# Altium schematic sheet UVEEC LED Cube.SchDoc
size A; SheetNumber: 1; SheetTotal: 1
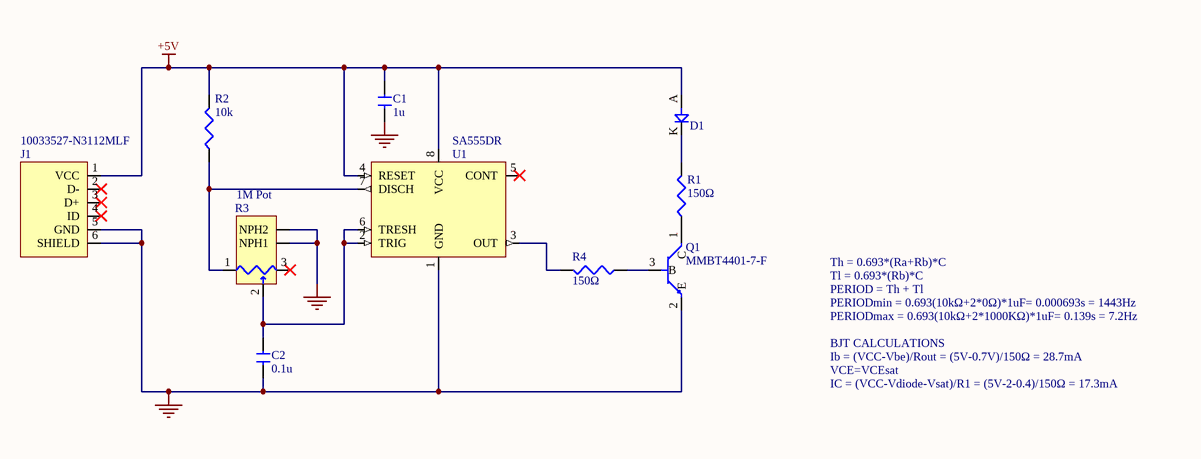
[diagram p0: UVEEC LED Cube.SchDoc]

## Parts
C1  1u  [Capacitor 1206]
C2  0.1u  [Capacitor 1206]
D1  HL3P-BF60-C00DD  [Diode TH D 1.05 P 2.54]  (value not drawn)
J1  10033527-N3112MLF  [10033527-N3112MLF]
Q1  MMBT4401-7-F  [SOT-23-3]
R1  150Ω  [Resistor 1206]
R2  10k  [Resistor 1206]
R3  1M Pot  [PDB12-H4301-105BF]
R4  150Ω  [Resistor 1206]
U1  SA555DR  [SOIC-8]

## Nets
+5V: C1.1 D1.A J1.1(VCC) R2.2 U1.4(RESET) U1.8(VCC)
GND: C1.2 C2.2 J1.5(GND) J1.6(SHIELD) Q1.2(E) R3.NPH1 R3.NPH2 U1.1(GND)
NetC2_1: C2.1 R3.2(WIPER) U1.2(TRIG) U1.6(TRESH)
NetD1_K: D1.K R1.2
NetQ1_1: Q1.1(C) R1.1
NetQ1_3: Q1.3(B) R4.1
NetR2_1: R2.1 R3.1(CCW) U1.7(DISCH)
NetR4_2: R4.2 U1.3(OUT)

Not connected (* = marked no-connect by the designer): J1 2(D-)* 3(D+)* 4(ID)*; R3 3(CW)*; U1 5(CONT)*

## Notes on the sheet
- Th = 0.693*(Ra+Rb)*C
- Tl = 0.693*(Rb)*C
- PERIOD = Th + Tl
- PERIODmin = 0.693(10kΩ+2*0Ω)*1uF= 0.000693s = 1443Hz
- PERIODmax = 0.693(10kΩ+2*1000KΩ)*1uF= 0.139s = 7.2Hz
- BJT CALCULATIONS
- Ib = (VCC-Vbe)/Rout = (5V-0.7V)/150Ω = 28.7mA
- VCE=VCEsat
- IC = (VCC-Vdiode-Vsat)/R1 = (5V-2-0.4)/150Ω = 17.3mA

## Library data of the parts
C1 = CL31B105KAHNFNE: Cap Ceramic 1uF 25V X7R 10% SMD 1206 125°C Embossed T/R; Manufacturer: Samsung; Supplier: Digi-Key; Supplier Part Number: 1276-3086-1-ND; Manufacturer Part Number: CL31B105KAHNFNE; RoHS: Yes; Category: Ceramic Capacitors; Stock: 266403; Pricing: 1=0.13, 10=0.094, 50=0.0534, 100=0.0443, 500=0.03106, 1000=0.02571 (USD); Mounting Technology: Surface Mount; Case/Package: 1206; Case Code (Metric): 3216; Case Code (Imperial): 1206; Min Operating Temperature: -55°C; Max Operating Temperature: 125°C; Packaging: Tape and Reel; Value: 1uF; Tolerance: 10%; Voltage Rating: 25V; Dielectric: X7R; Series: CL; Construction: Flat; Length: 3.2mm; Height: 1.6mm; Depth: 1.6mm; Radiation Hardening: No; RoHS Compliant: Yes; ComponentLink1URL: https://datasheet.ciiva.com/25731/cl31b105kahnfne-25731284.pdf?src-supplier=Digi-Key; ComponentLink1Description: https://datasheet.ciiva.com/25731/cl31b105kahnfne-25731284.pdf?src-supplier=Digi-Key
C2 = CL31B104KBCNNNC: Multilayer Ceramic Capacitor, 0.1 uF, 50 V, ± 10%, X7R, 1206 [3216 Metric]; Manufacturer: Samsung; Value: 100nF; Voltage: 50V; Supplier: Digi-Key; Supplier Part Number: 1276-1017-1-ND; Manufacturer Part Number: CL31B104KBCNNNC; RoHS: Yes; Category: Ceramic Capacitors; Stock: 760991; Pricing: 1=0.11, 10=0.078, 50=0.0444, 100=0.0368, 500=0.02582, 1000=0.02137 (USD); Mounting Technology: Surface Mount; Case/Package: 1206; Case Code (Metric): 3216; Case Code (Imperial): 1206; Material: Ceramic; Min Operating Temperature: -55°C; Max Operating Temperature: 125°C; Tolerance: 10%; Dielectric: X7R; Voltage Rating (DC): 50V; Packaging: Tape and Reel; Voltage Rating: 50V; Series: CL; Length: 3.2mm; Height: 0.85mm; Depth: 1.6mm; Lead Free: Lead Free; RoHS Compliant: Yes; ComponentLink1URL: https://datasheet.ciiva.com/25710/cl31b104kbcnnnc-25710293.pdf?src-supplier=Digi-Key; ComponentLink1Description: https://datasheet.ciiva.com/25710/cl31b104kbcnnnc-25710293.pdf?src-supplier=Digi-Key; ComponentLink2URL: https://datasheet.ciiva.com/29201/451941-da-01-en-vs-kondensator-1206-29201689.pdf?src-supplier=Conrad; ComponentLink2Description: https://datasheet.ciiva.com/29201/451941-da-01-en-vs-kondensator-1206-29201689.pdf?src-supplier=Conrad; ComponentLink3URL: https://datasheet.ciiva.com/16298/cl05b104kq5nnnc-16298186.pdf?src-supplier=Future+Electronics; ComponentLink3Description: https://datasheet.ciiva.com/16298/cl05b104kq5nnnc-16298186.pdf?src-supplier=Future+Electronics
D1 = HL3P-BF60-C00DD: LED Yellow Green 570nm 20mA 2-Pin Through Hole T/R; Manufacturer: Broadcom; Supplier: Digi-Key; Supplier Part Number: 516-HL3P-BF60-C00DDCT-ND; Manufacturer Part Number: HL3P-BF60-C00DD; RoHS: No; Stock: 26786; Pricing: 1=0.58, 10=0.384, 100=0.2541, 1000=0.19616 (USD)
J1 = 10033527-N3112MLF: MINI USB 2.0- AB Type Receptacle conn. Right Angle Surface Mount Type; Manufacturer: Amphenol ICC / FCI; Number of Ports: 1; Gender: Female; Pitch: 0.8mm; Supplier: Digi-Key; Supplier Part Number: 609-10033527-N3112MLFCT-ND; Manufacturer Part Number: 10033527-N3112MLF; RoHS: Yes; Category: Connectors; Stock: 11754; Pricing: 1=0.51, 10=0.446, 25=0.4076, 50=0.3838, 100=0.3677, 250=0.33576 (USD); Mounting Technology: Surface Mount; Contact Material: Copper Alloy; Contact Plating: Gold; Housing Material: Polymer; Packaging: Tape and Reel; Package Quantity: 750; Termination: Solder; Orientation: Right Angle; Length: 9.9mm; Depth: 9.2mm; RoHS Compliant: Yes; ComponentLink1URL: https://datasheet.ciiva.com/3094/10033527-3094701.pdf?src-supplier=Avnet; ComponentLink1Description: https://datasheet.ciiva.com/3094/10033527-3094701.pdf?src-supplier=Avnet
Q1 = MMBT4401-7-F: NPN Ic=600mA Vceo=40V hfe=100~300 fT=250MHz P=310mW SOT-23; Manufacturer: Diodes; Max Power Dissipation: 300mW; Frequency: 250MHz; Collector Emitter Voltage (VCEO): 40V; hFE Min: 100; Number of Elements: 1; Max Collector Current: 600mA; Collector Base Voltage (VCBO): 60V; Emitter Base Voltage (VEBO): 6V; Collector Emitter Saturation Voltage: 750mV; Power Dissipation: 310mW; Supplier: Digi-Key; Supplier Part Number: MMBT4401-FDICT-ND; Manufacturer Part Number: MMBT4401-7-F; RoHS: Yes; Category: BJTs; Stock: 950358; Pricing: 1=0.14, 10=0.098, 100=0.0528, 500=0.04146, 1000=0.02878 (USD); Mounting Technology: Surface Mount; Case/Package: SOT-23; Pins: 3; Weight: 0.000282oz; Min Operating Temperature: -55°C; Max Operating Temperature: 150°C; Polarity: NPN; Packaging: Tape and Reel; Package Quantity: 3000; Transition Frequency: 250MHz; Collector Emitter Breakdown Voltage: 40V; Max Breakdown Voltage: 40V; Continuous Collector Current: 600mA; Clock Frequency: 250MHz; Gain Bandwidth Product: 250MHz; Voltage Rating (DC): 40V; Series: Automotive, AEC-Q101; Collector-emitter Voltage-Max: 750mV; Length: 3.05mm; Width: 1.4mm; Height: 1mm; Radiation Hardening: No; Reach SVHC Compliant: Yes; Lead Free: Lead Free; RoHS Compliant: Yes; ComponentLink1URL: https://datasheet.ciiva.com/15139/getdatasheetpartid-91436-15139165.pdf?src-supplier=Verical; ComponentLink1Description: https://datasheet.ciiva.com/15139/getdatasheetpartid-91436-15139165.pdf?src-supplier=Verical; ComponentLink2URL: https://datasheet.ciiva.com/972/ds30039-972547.pdf?src-supplier=Digi-Key; ComponentLink2Description: https://datasheet.ciiva.com/972/ds30039-972547.pdf?src-supplier=Digi-Key; ComponentLink3URL: https://datasheet.ciiva.com/972/ds30039-972548.pdf?src-supplier=Digi-Key; ComponentLink3Description: https://datasheet.ciiva.com/972/ds30039-972548.pdf?src-supplier=Digi-Key; ComponentLink4URL: https://datasheet.ciiva.com/972/ds30039-972549.pdf?src-supplier=Digi-Key; ComponentLink4Description: https://datasheet.ciiva.com/972/ds30039-972549.pdf?src-supplier=Digi-Key; ComponentLink5URL: https://datasheet.ciiva.com/16199/ds30039-16199054.pdf?src-supplier=Future+Electronics; ComponentLink5Description: https://datasheet.ciiva.com/16199/ds30039-16199054.pdf?src-supplier=Future+Electronics; ComponentLink6URL: https://datasheet.ciiva.com/11201/ds30039-11201820.pdf?src-supplier=Avnet; ComponentLink6Description: https://datasheet.ciiva.com/11201/ds30039-11201820.pdf?src-supplier=Avnet
R1 R4 = RMCF1206FG150R: RES 150 OHM 1% 1/4W 1206; Manufacturer: Stackpole Electronics; Value: 150R; Max Power Dissipation: 250mW; Temperature Coefficient: 100ppm/°C; Supplier: Digi-Key; Supplier Part Number: RMCF1206FG150RCT-ND; Manufacturer Part Number: RMCF1206FG150R; RoHS: Yes; Category: Chip SMD Resistors; Stock: 105204; Pricing: 1=0.1, 10=0.023, 50=0.0146, 100=0.0122, 500=0.00832, 1000=0.00718, 5000=0.00526 (USD); Mounting Technology: Surface Mount; Case/Package: 1206; Case Code (Metric): 3216; Case Code (Imperial): 1206; Contact Plating: Tin,Matte; Min Operating Temperature: -55°C; Max Operating Temperature: 155°C; Packaging: Tape and Reel; Tolerance: 1%; Number of Terminations: 2; Features: Automotive AEC-Q200; Series: RMCF; Ratings: AEC-Q200; Radiation Hardening: No; RoHS Compliant: Yes; ComponentLink1URL: https://www.seielect.com/catalog/SEI-RMCF_RMCP.pdf?src-supplier=Avnet; ComponentLink1Description: https://www.seielect.com/catalog/SEI-RMCF_RMCP.pdf?src-supplier=Avnet; ComponentLink2URL: https://www.seielect.com/catalog/sei-rmcf_rmcp.pdf?src-supplier=Digi-Key; ComponentLink2Description: https://www.seielect.com/catalog/sei-rmcf_rmcp.pdf?src-supplier=Digi-Key; ComponentLink3URL: https://www.seielect.com/catalog/SEI-Packaging.pdf?src-supplier=Digi-Key; ComponentLink3Description: https://www.seielect.com/catalog/SEI-Packaging.pdf?src-supplier=Digi-Key
R2 = RMCF1206FT10K0: Res Thick Film 1206 10K Ohm 1% 0.25W ±100ppm/°C Molded SMD Paper T/R; Manufacturer: Stackpole Electronics; Value: 10kR; Power Rating: 250mW; Voltage Rating: 200V; Supplier: Digi-Key; Supplier Part Number: RMCF1206FT10K0CT-ND; Manufacturer Part Number: RMCF1206FT10K0; RoHS: Yes; Category: Chip SMD Resistors; Stock: 1414203; Pricing: 1=0.1, 10=0.023, 50=0.0146, 100=0.0122, 500=0.00832, 1000=0.00718 (USD); Mounting Technology: Surface Mount; Case/Package: 1206; Case Code (Metric): 3216; Case Code (Imperial): 1206; Contact Plating: Tin,Matte; Min Operating Temperature: -55°C; Max Operating Temperature: 155°C; Tolerance: 1%; Packaging: Tape and Reel; Number of Terminations: 2; Max Power Dissipation: 250mW; Temperature Coefficient: 100ppm/°C; Features: Automotive AEC-Q200; Series: RMCF; Construction: Rectangular; Length: 3.2mm; Width: 0.063inch; Height: 0.028inch; Depth: 1.6mm; Ratings: AEC-Q200; Radiation Hardening: No; Military Standard: Not; Lead Free: Lead Free; RoHS Compliant: Yes; ComponentLink1URL: https://datasheet.ciiva.com/15193/getdatasheetpartid-369489-15193659.pdf?src-supplier=Verical; ComponentLink1Description: https://datasheet.ciiva.com/15193/getdatasheetpartid-369489-15193659.pdf?src-supplier=Verical
R3 = PDB12-H4301-105BF: Res Carbon Film POT 1M Ohm 20% 2/25W 1(Elec)/1(Mech)Turn 6mm (12.4 X 34.6mm) Pin Bracket Mount/Through Hole; Manufacturer: Bourns; Value: 1MR; Power Rating: 80mW; Number of Turns: 1; Supplier: Digi-Key; Supplier Part Number: PDB12-H4301-105BF-ND; Manufacturer Part Number: PDB12-H4301-105BF; RoHS: Yes; Category: Variable Resistors and Potentiometers; Stock: 887; Pricing: 1=1.28, 10=1.133, 25=1.02, 50=0.9822, 100=0.9444, 250=0.88768, 500=0.75548, 1000=0.69882, 5000=0.57416 (USD); Mounting Technology: Through Hole,Brackets; Min Operating Temperature: -10°C; Max Operating Temperature: 50°C; Package Quantity: 100; Packaging: Bulk; Tolerance: 20%; Resistor Type: Carbon; Taper: Linear; Termination: Pin; Number of Gangs: 1; Max Power Dissipation: 80mW; Type: Potentiometer; Series: PDB12; Technology: CARBON FILM; Length: 12.4mm; Depth: 12.4mm; Radiation Hardening: No; Military Standard: Not; RoHS Compliant: Yes; ComponentLink1URL: https://datasheet.ciiva.com/26913/getdatasheetpartid-380329-26913658.pdf?src-supplier=Verical; ComponentLink1Description: https://datasheet.ciiva.com/26913/getdatasheetpartid-380329-26913658.pdf?src-supplier=Verical; ComponentLink2URL: https://datasheet.ciiva.com/8702/pdb12-8702733.pdf?src-supplier=Avnet; ComponentLink2Description: https://datasheet.ciiva.com/8702/pdb12-8702733.pdf?src-supplier=Avnet
U1 = SA555DR: IC OSC SGL TIMER 100KHZ 8-SOIC; Manufacturer: Texas Instruments; Min Supply Voltage: 4.5V; Max Supply Voltage: 16V; Operating Supply Current: 10mA; Number of Timers/Counters: 1; Quiescent Current: 15mA; High Level Output Current: -200mA; Low Level Output Current: 200mA; Supply Current: 2mA; Supplier: Digi-Key; Supplier Part Number: 296-14635-1-ND; Manufacturer Part Number: SA555DR; RoHS: Yes; Category: Timers and Oscillators; Stock: 21612; Pricing: 1=0.38, 10=0.31, 25=0.2836, 100=0.2109, 250=0.19116, 500=0.1582, 1000=0.11864 (USD); Mounting Technology: Surface Mount; Case/Package: SOIC; Pins: 8; Weight: 0.002561oz; Min Operating Temperature: -40°C; Max Operating Temperature: 85°C; Frequency: 100kHz; Packaging: Tape and Reel; Package Quantity: 2500; Series: -; Radiation Hardening: No; Lead Free: Lead Free; RoHS Compliant: Yes; Reach SVHC Compliant: No; ComponentLink1URL: https://datasheet.ciiva.com/34303/1998263-34303726.pdf?src-supplier=Jameco; ComponentLink1Description: https://datasheet.ciiva.com/34303/1998263-34303726.pdf?src-supplier=Jameco; ComponentLink2URL: https://datasheet.ciiva.com/1592/1748907-1592972.pdf?src-supplier=Newark; ComponentLink2Description: https://datasheet.ciiva.com/1592/1748907-1592972.pdf?src-supplier=Newark; ComponentLink3URL: https://datasheet.ciiva.com/46413/1834004-46413322.pdf?src-supplier=Element14; ComponentLink3Description: https://datasheet.ciiva.com/46413/1834004-46413322.pdf?src-supplier=Element14; ComponentLink4URL: https://datasheet.ciiva.com/1233/sa555-1233135.pdf?src-supplier=Digi-Key; ComponentLink4Description: https://datasheet.ciiva.com/1233/sa555-1233135.pdf?src-supplier=Digi-Key; ComponentLink5URL: https://datasheet.ciiva.com/1233/sa555-1233134.pdf?src-supplier=Digi-Key; ComponentLink5Description: https://datasheet.ciiva.com/1233/sa555-1233134.pdf?src-supplier=Digi-Key; ComponentLink6URL: https://datasheet.ciiva.com/1233/sa555-1233136.pdf?src-supplier=Digi-Key; ComponentLink6Description: https://datasheet.ciiva.com/1233/sa555-1233136.pdf?src-supplier=Digi-Key; ComponentLink7URL: https://datasheet.ciiva.com/14274/se555m-14274469.pdf?src-supplier=Avnet; ComponentLink7Description: https://datasheet.ciiva.com/14274/se555m-14274469.pdf?src-supplier=Avnet; ComponentLink8URL: https://datasheet.ciiva.com/15152/getdatasheetpartid-247856-15152619.pdf?src-supplier=Verical; ComponentLink8Description: https://datasheet.ciiva.com/15152/getdatasheetpartid-247856-15152619.pdf?src-supplier=Verical